# Altium project template.PrjPcb
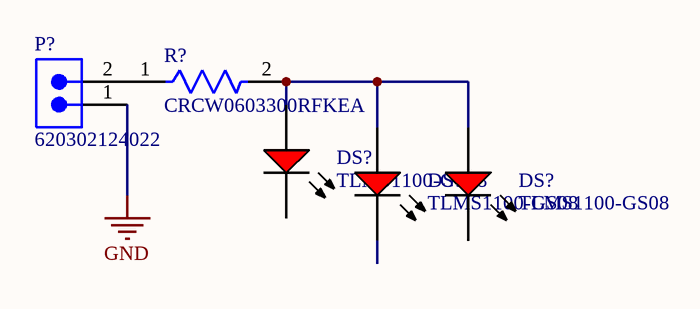
[diagram p0: TOP.SchDoc]
4 sheets, 31 parts. Net scope: hierarchical (ports join the sheet entries above them; power ports are global).
Board file: PCB.PcbDoc
Sheets:
  TOP.SchDoc
  Sensors.SchDoc
  STM.SchDoc
  Headers.SchDoc

## Sheet TOP.SchDoc: =DocumentName
size A4; Organization: Queen's Formula SAE; Address1: 130 Stuart St, Kingston; Address2: Ontario; Address3: Canada; Address4: K7L 2V9; DocumentNumber: 1; Revision: 0; SheetNumber: 1; SheetTotal: 1

### Parts
(Parts that share a designator on the sheet are numbered #1, #2 ... from top to bottom, then left to right.)
DS?#1  TLMS1100-GS08  [VISH-TLMX1100_V]
DS?#2  TLMS1100-GS08  [VISH-TLMX1100_V]
DS?#3  TLMS1100-GS08  [VISH-TLMX1100_V]
P?  620302124022  [620302124022]
R?  CRCW0603300RFKEA  [FP-CRCW0603-e3-IPC_A]

### Nets
GND: P?.1
NetDS?#1_1: DS?#1.1(A) DS?#2.1(A) DS?#3.1(A) R?.2
NetP?_2: P?.2 R?.1

Not connected (* = marked no-connect by the designer): DS?#1 2(K); DS?#2 2(K); DS?#3 2(K)

### Notes on the sheet
- Title
- Size:
- Date:
- A4
- Number:
- Time:
- Revision:
- Sheet
- of
- File:

### Library data of the parts
DS?#1-DS?#3 = CMP-1666-00027-1: LED, RED, 2.1 V, -40 to 100 degC, 2-Pin SMD (0603), RoHS, Tape and Reel; Type (Capacitors): C0G; Resistance: 100000000000 Ohm; Capacitance: 12 pF; Voltage Rating: 50 V; Tolerance: 5%; Min Operating Temperature: -55degC; REACH SVHC: No SVHC; ComponentLink2Description: Datasheet; ComponentLink1URL: http://www.vishay.com/; Width: 0.8 mm; Package Quantity: 4000; PackageReference: TLMX1100; ComponentLink2URL: http://www.vishay.com/docs/83173/tlmb1100.pdf; Case/Package: 0603; Case Code (Metric): 1608; Packaging: Tape and Reel; Pins: 2; ComponentLink1Description: Manufacturer URL; Max Operating Temperature: 125degC; Height: 0.8 mm; Length: 1.6 mm; Mount: Surface Mount; PackageDescription: 2-Pin Surface Mount Device, Body 1.6 x 0.8 mm; DatasheetVersion: Rev. 2.7, 03/2016; Case Code (Imperial): 0603; Voltage Rating (DC): 50 V; RoHSCompliant: True; Radiation Hardening: No
P? = CMP-1502-00660-2: NexarPartId: 18818242; Insulation: Insulated; Connector Type: Male Pin; Pitch: 2mm; Insulation Resistance: 1GΩ; Gender: Male; Voltage Rating: 125V; Number of Positions: 2; Contact Resistance: 20mΩ; Operating Supply Voltage: 100V; Current Rating: 2A; Contact Material: Copper; Number of Rows: 1; Flammability Rating: UL94 V-0; Housing Material: Nylon; Lead Pitch: 2mm; Orientation: Vertical; Max Operating Temperature: 85°C; Termination: SMD/SMT; REACH SVHC: Unknown; Contact Mating Length: 3.5052mm; RoHS: Compliant; Packaging: Tape and Reel; Number of Contacts: 2; Height: 6.6mm; Mount: Surface Mount; Number of Pins: 2; Contact Gender: Male; Min Operating Temperature: -40°C; Length: 5mm; Width: 7.9mm; Contact Plating: Tin; Color: Beige, White
R? = CMP-2000-03216-2: RES Thick Film, 300Ω, 1%, 0.1W, 100ppm/°C, 0603; Voltage Rating (DC): 75V; Power Rating: 100mW; Resistance: 300R; Length: 1.55mm; Height: 0.45mm; Case/Package: 0603; Temperature Coefficient: 100ppm/°C; Packaging: Tape and Reel; Termination: SMD/SMT; Depth: 0.85mm; Max Operating Temperature: 155°C; Radiation Hardening: No; Tolerance: 1%; Lead Free: Lead Free; Case Code (Metric): 1608; Voltage Rating: 75V; Weight: 7.1E-05oz; Package Quantity: 10; Military Standard: Not; Case Code (Imperial): 0603; Composition: Thick Film; Min Operating Temperature: -55°C; Width: 0.033inch; Number of Terminations: 2; Mount: Surface Mount; Features: Automotive AEC-Q200; Contact Plating: Tin; Max Power Dissipation: 100mW

## Sheet Sensors.SchDoc
size A4
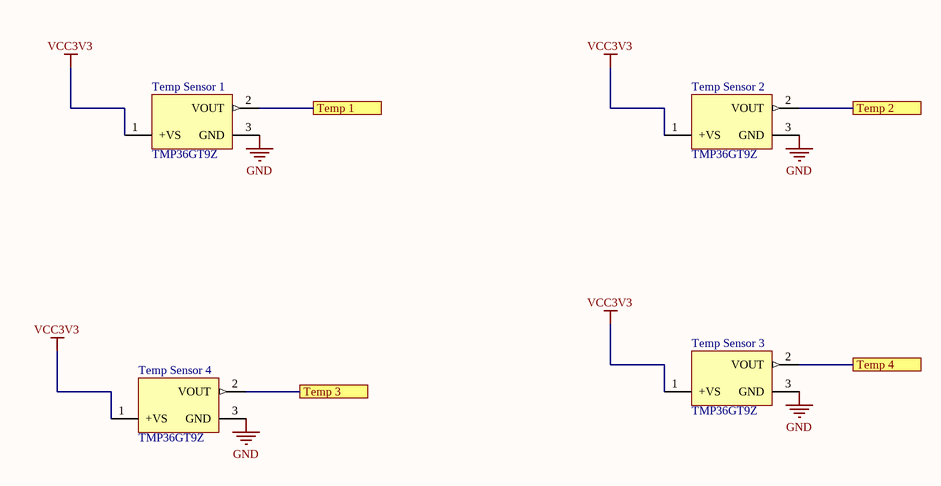
[diagram p1: Sensors.SchDoc]

### Parts
Temp_Sensor_1  TMP36GT9Z  [ADI-T-3]
Temp_Sensor_2  TMP36GT9Z  [ADI-T-3]
Temp_Sensor_3  TMP36GT9Z  [ADI-T-3]
Temp_Sensor_4  TMP36GT9Z  [ADI-T-3]

### Ports
Temp 1, Temp 2, Temp 3, Temp 4

### Nets
GND: Temp_Sensor_1.3(GND) Temp_Sensor_2.3(GND) Temp_Sensor_3.3(GND) Temp_Sensor_4.3(GND)
VCC3V3: Temp_Sensor_1.1(+VS) Temp_Sensor_2.1(+VS) Temp_Sensor_3.1(+VS) Temp_Sensor_4.1(+VS)
Temp 1: Temp_Sensor_1.2(VOUT) ; port Temp 1
Temp 2: Temp_Sensor_2.2(VOUT) ; port Temp 2
Temp 3: Temp_Sensor_4.2(VOUT) ; port Temp 3
Temp 4: Temp_Sensor_3.2(VOUT) ; port Temp 4

### Library data of the parts
Temp_Sensor_1-Temp_Sensor_4 = CMP-0887-00067-1: Low Voltage Temperature Sensor, 2.7 to 5.5 V Supply, Industrial, 3-pin TO92 (T-3), Tray; Manufacturer: Analog Devices; ComponentLink2Description: Datasheet; PackageReference: T-3; Packing: Tray; ComponentLink2URL: http://www.analog.com/static/imported-files/data_sheets/TMP35_36_37.pdf; ComponentLink4Description: Product URL; ComponentLink3Description: Package Specification; Code_JEDEC: TO-226-AA; PartNumber: TMP36GT9Z; PackageDescription: 3-Pin Plastic Header-Style Package, 1.27 mm Pitch; PackageVersion: 042208-A, 04/2008; ComponentLink3URL: http://www.analog.com/static/imported-files/packages/PKG_PDF/TO-92(T)/T_3.pdf; ComponentLink1Description: Manufacturer URL; Supply Voltage Range: 2.7 to 5.5 V; Mounting Technology: Through Hole; DatasheetVersion: Rev. F; ComponentLink4URL: http://www.analog.com/en/mems-sensors/digital-temperature-sensors/tmp36/products/product.html; ComponentLink1URL: http://www.analog.com/en/index.html

## Sheet STM.SchDoc
size A4
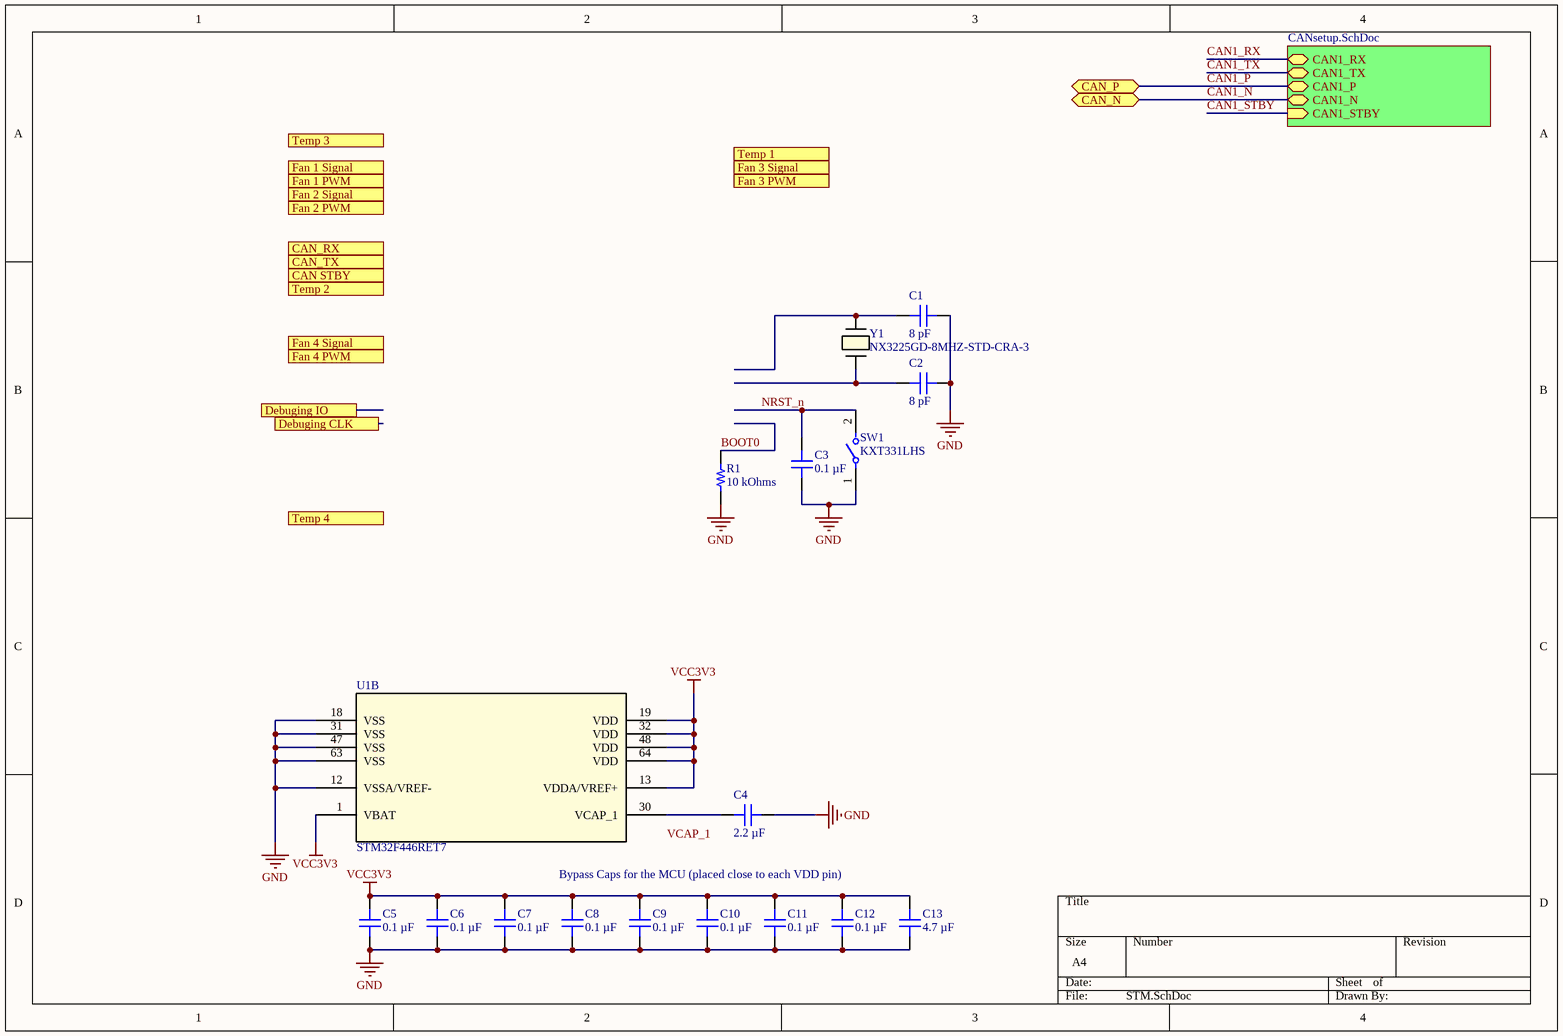
[diagram p2: STM.SchDoc]

### Parts
C1  8 pF  [CAP 0402_1005]
C2  8 pF  [CAP 0402_1005]
C3  0.1 µF  [CAP 01005_0402]
C4  2.2 µF  [CAP 0402_1005]
C5  0.1 µF  [CAP 01005_0402]
C6  0.1 µF  [CAP 01005_0402]
C7  0.1 µF  [CAP 01005_0402]
C8  0.1 µF  [CAP 01005_0402]
C9  0.1 µF  [CAP 01005_0402]
C10  0.1 µF  [CAP 01005_0402]
C11  0.1 µF  [CAP 01005_0402]
C12  0.1 µF  [CAP 01005_0402]
C13  4.7 µF  [CAP 0402_1005]
R1  10 kOhms  [RES 0201_0603]
SW1  KXT331LHS  [FP-KXT331LHS-MFG]
U1  STM32F446RET7  [LQFP64-10x10mm]  (part B of 2)
Y1  NX3225GD-8MHZ-STD-CRA-3  [XTAL_NX3225GD-8MHZ-STD-CRA-3_NDK]

### Sub-sheets
CAN = CANsetup.SchDoc (file not in this document): CAN1_RX (bidir), CAN1_TX (bidir), CAN1_STBY (in), CAN1_P (bidir), CAN1_N (bidir)

### Ports
CAN STBY, CAN_N (bidir), CAN_P (bidir), CAN_RX, CAN_TX, Debuging CLK, Debuging IO, Fan 1 PWM, Fan 1 Signal, Fan 2 PWM, Fan 2 Signal, Fan 3 PWM, Fan 3 Signal, Fan 4 PWM, Fan 4 Signal, Temp 1, Temp 2, Temp 3, Temp 4

### Nets
GND: C1.1 C2.1 C3.2 C4.1 C5.2 C6.2 C7.2 C8.2 C9.2 C10.2 C11.2 C12.2 C13.1 R1.1 SW1.1 U1.12(VSSA/VREF-) U1.18(VSS) U1.31(VSS) U1.47(VSS) U1.63(VSS)
VCC3V3: C5.1 C6.1 C7.1 C8.1 C9.1 C10.1 C11.1 C12.1 C13.2 U1.1(VBAT) U1.13(VDDA/VREF+) U1.19(VDD) U1.32(VDD) U1.48(VDD) U1.64(VDD)
BOOT0: R1.2
CAN1_N: port CAN_N, sheet CAN/CAN1_N
CAN1_P: port CAN_P, sheet CAN/CAN1_P
CAN1_RX: sheet CAN/CAN1_RX
CAN1_STBY: sheet CAN/CAN1_STBY
CAN1_TX: sheet CAN/CAN1_TX
NRST_n: C3.1 SW1.2
NetC1_2: C1.2 Y1.1
NetC2_2: C2.2 Y1.2
NetC4_2: C4.2 U1.30(VCAP_1)

### Notes on the sheet
- Bypass Caps for the MCU (placed close to each VDD pin)
- Labels drawn without touching a wire or pin: VCAP_1

### Library data of the parts
C1 C2 = GCM1555C1H8R0FA16D: CAP CER 8PF 50V C0G/NP0 0402; manufacturer: Murata Electronics; Temperature Coefficient: C0G, NP0; Tolerance: ±1%; Part Number: GCM1555C1H8R0FA16D; Value: 8 pF; Applications: Automotive; Capacitance: 8 pF; componentlink1description: Datasheet; componentlink1url: https://search.murata.co.jp/Ceramy/image/img/A01X/G101/ENG/GCM1555C1H8R0FA16-01.pdf; componentlink2description: DigiKey Link; componentlink2url: https://www.digikey.com/en/products/detail/murata-electronics/GCM1555C1H8R0FA16D/11618789; Device Package: 0402 (1005 Metric); lastupdated: 2024-01-11 8:04:05 PM; Lifecycle Status: Active; Minimum Order: 1; Mounting Type: Surface Mount, MLCC; Operating Temperature: -55°C ~ 125°C; Package / Case: 0402 (1005 Metric); packaging: TapeAndReel; partid: 34002; Part Status: Active; price: 0.01; Ratings: AEC-Q200; series: GCM; Size / Dimension: 0.039" L x 0.020" W (1.00mm x 0.50mm); Supplier 1: DigiKey; Supplier Part Number 1: 490-GCM1555C1H8R0FA16DCT-ND; Thickness (Max): 0.022" (0.55mm); Voltage - Rated: 50V
C3 C5-C12 = CL02A104KQ2NNNC: CAP CER 0.1UF 6.3V X5R 01005; manufacturer: Samsung Electro-Mechanics; Tolerance: ±10%; Part Number: CL02A104KQ2NNNC; Value: 0.1 µF; Applications: General Purpose; Capacitance: 0.1 µF; componentlink1description: Datasheet; componentlink1url: http://www.samsungsem.com/kr/support/product-search/mlcc/CL02A104KQ2NNNC.jsp; componentlink2description: DigiKey Link; componentlink2url: https://www.digikey.com/en/products/detail/samsung-electro-mechanics/CL02A104KQ2NNNC/3886867; Device Package: 01005 (0402 Metric); lastupdated: 2023-11-30 9:46:05 PM; Lifecycle Status: Active; Minimum Order: 1; Mounting Type: Surface Mount, MLCC; Operating Temperature: -55°C ~ 85°C; Package / Case: 01005 (0402 Metric); packaging: TapeAndReel; Part Status: Active; price: 0.02; series: CL; Size / Dimension: 0.016" L x 0.008" W (0.40mm x 0.20mm); Supplier 1: DigiKey; Supplier Part Number 1: 1276-1209-1-ND; Temperature Coefficient: X5R; Thickness (Max): 0.009" (0.22mm); Voltage - Rated: 6.3V
C4 = CL05A225KO5NQNC: CAP CER 2.2UF 16V X5R 0402; manufacturer: Samsung Electro-Mechanics; Tolerance: ±10%; Part Number: CL05A225KO5NQNC; Value: 2.2 µF; Applications: General Purpose; Capacitance: 2.2 µF; componentlink1description: Datasheet; componentlink1url: http://www.samsungsem.com/kr/support/product-search/mlcc/CL05A225KO5NQNC.jsp; componentlink2description: DigiKey Link; componentlink2url: https://www.digikey.com/en/products/detail/samsung-electro-mechanics/CL05A225KO5NQNC/3887119; Device Package: 0402 (1005 Metric); lastupdated: 2024-01-11 8:04:27 PM; Lifecycle Status: Active; Minimum Order: 1; Mounting Type: Surface Mount, MLCC; Operating Temperature: -55°C ~ 85°C; Package / Case: 0402 (1005 Metric); packaging: TapeAndReel; partid: 1761; Part Status: Active; price: 0.03; series: CL; Size / Dimension: 0.039" L x 0.020" W (1.00mm x 0.50mm); Supplier 1: DigiKey; Supplier Part Number 1: 1276-1461-1-ND; Temperature Coefficient: X5R; Thickness (Max): 0.022" (0.55mm); Voltage - Rated: 16V
C13 = CL05A475MO5NUNC: CAP CER 4.7UF 16V X5R 0402; manufacturer: Samsung Electro-Mechanics; Tolerance: ±20%; Part Number: CL05A475MO5NUNC; Value: 4.7 µF; Applications: General Purpose; Capacitance: 4.7 µF; componentlink1description: Datasheet; componentlink1url: http://www.samsungsem.com/kr/support/product-search/mlcc/__icsFiles/afieldfile/2019/05/29/Data%20sheet_CL05A475MO5NUNC.pdf; componentlink2description: DigiKey Link; componentlink2url: https://www.digikey.com/en/products/detail/samsung-electro-mechanics/CL05A475MO5NUNC/5961320; Device Package: 0402 (1005 Metric); lastupdated: 2024-01-11 8:04:27 PM; Lifecycle Status: Active; Minimum Order: 1; Mounting Type: Surface Mount, MLCC; Operating Temperature: -55°C ~ 85°C; Package / Case: 0402 (1005 Metric); packaging: TapeAndReel; partid: 1760; Part Status: Active; price: 0.08; series: CL; Size / Dimension: 0.039" L x 0.020" W (1.00mm x 0.50mm); Supplier 1: DigiKey; Supplier Part Number 1: 1276-6836-1-ND; Temperature Coefficient: X5R; Thickness (Max): 0.028" (0.70mm); Voltage - Rated: 16V
R1 = CRCW020110K0FKED: RES SMD 10K OHM 1% 1/20W 0201; Manufacturer: Vishay Dale; Power (Watts): 0.05W, 1/20W; Temperature Coefficient: ±100ppm/°C; Part Number: CRCW020110K0FKED; Value: 10 kOhms; ComponentLink1Description: Datasheet; ComponentLink1URL: http://www.vishay.com/docs/20052/crcw0201e3.pdf; ComponentLink2Description: DigiKey Link; ComponentLink2URL: https://www.digikey.com/en/products/detail/vishay-dale/CRCW020110K0FKED/1967989; Composition: Thick Film; Device Package: 0201 (0603 Metric); Height - Seated (Max): 0.010" (0.26mm); LastUpdated: 2024-01-11 8:21:19 PM; Lifecycle Status: Active; Minimum Order: 1; Number of Terminations: 2; Operating Temperature: -55°C ~ 155°C; Package / Case: 0201 (0603 Metric); Packaging: TapeAndReel; PartId: 29; Part Status: Active; Price: 0.02; Resistance: 10 kOhms; Series: CRCW; Size / Dimension: 0.024" L x 0.012" W (0.60mm x 0.30mm); Supplier 1: DigiKey; Supplier Part Number 1: 541-10.0KAABCT-ND; Supplier Device Package: 0201; Tolerance: ±1%
SW1 = CMP-10040-000029-1: SWITCH TACTILE SPST-NO 0.02A 15V; Operating Force: 240gf; Switch Travel: 0.13mm; Illumination Type: Non-Illuminated; Throw Configuration: SPST; Number of Ports: 1; Current Rating: 5A; Mechanical Life: 500000Cycles; Switch Function: Off-Mom; Connector Type: USB; Actuator Type: Standard; Gender: Receptacle; Number of Contacts: 24; Contact Plating: Gold; Insulation Color: Black; Min Operating Temperature: -40°C; Packaging: Tape and Reel; Flammability Rating: UL94 V-0; Max Operating Temperature: 85°C; Termination: Solder; Mount: Surface Mount
U1 = STM32F446RET7: No Description Available; Mfr_Name: STMicroelectronics; Copyright: Copyright (C) 2024 Ultra Librarian. All rights reserved.; Manufacturer_Part_Number: STM32F446RET7; RefDes: RefDes; Type: DEV
Y1 = NX3225GD-8MHZ-STD-CRA-3: No Description Available; Mfr_Name: NDK; Copyright: Copyright (C) 2024 Ultra Librarian. All rights reserved.; Manufacturer_Part_Number: NX3225GD-8MHZ-STD-CRA-3; RefDes: RefDes; Type: DEV

## Sheet Headers.SchDoc
size A4
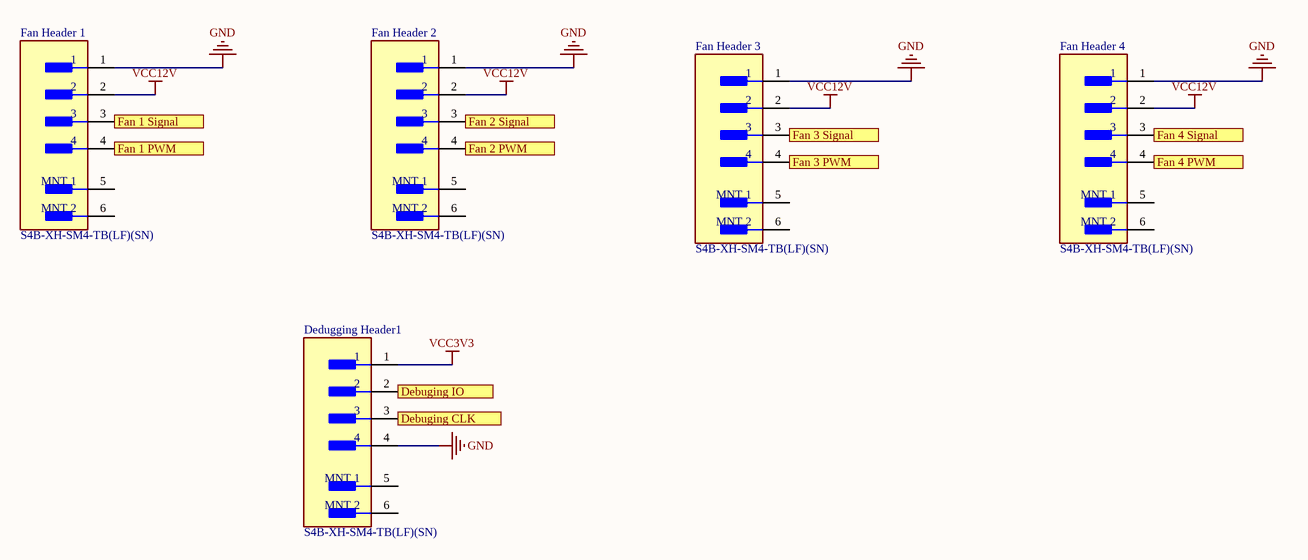
[diagram p3: Headers.SchDoc]

### Parts
Dedugging_Header1  S4B-XH-SM4-TB(LF)(SN)  [FP-S4B-XH-SM4-TB_LF_SN-MFG]
Fan_Header_1  S4B-XH-SM4-TB(LF)(SN)  [FP-S4B-XH-SM4-TB_LF_SN-MFG]
Fan_Header_2  S4B-XH-SM4-TB(LF)(SN)  [FP-S4B-XH-SM4-TB_LF_SN-MFG]
Fan_Header_3  S4B-XH-SM4-TB(LF)(SN)  [FP-S4B-XH-SM4-TB_LF_SN-MFG]
Fan_Header_4  S4B-XH-SM4-TB(LF)(SN)  [FP-S4B-XH-SM4-TB_LF_SN-MFG]

### Ports
Debuging CLK, Debuging IO, Fan 1 PWM, Fan 1 Signal, Fan 2 PWM, Fan 2 Signal (out), Fan 3 PWM, Fan 3 Signal, Fan 4 PWM, Fan 4 Signal

### Nets
GND: Dedugging_Header1.4 Fan_Header_1.1 Fan_Header_2.1 Fan_Header_3.1 Fan_Header_4.1
VCC3V3: Dedugging_Header1.1
VCC12V: Fan_Header_1.2 Fan_Header_2.2 Fan_Header_3.2 Fan_Header_4.2
Debuging CLK: Dedugging_Header1.3 ; port Debuging CLK
Debuging IO: Dedugging_Header1.2 ; port Debuging IO
Fan 1 PWM: Fan_Header_1.4 ; port Fan 1 PWM
Fan 1 Signal: Fan_Header_1.3 ; port Fan 1 Signal
Fan 2 PWM: Fan_Header_2.4 ; port Fan 2 PWM
Fan 2 Signal: Fan_Header_2.3 ; port Fan 2 Signal
Fan 3 PWM: Fan_Header_3.4 ; port Fan 3 PWM
Fan 3 Signal: Fan_Header_3.3 ; port Fan 3 Signal
Fan 4 PWM: Fan_Header_4.4 ; port Fan 4 PWM
Fan 4 Signal: Fan_Header_4.3 ; port Fan 4 Signal

Not connected (* = marked no-connect by the designer): Dedugging_Header1 5(MNT_1) 6(MNT_2); Fan_Header_1 5(MNT_1) 6(MNT_2); Fan_Header_2 5(MNT_1) 6(MNT_2); Fan_Header_3 5(MNT_1) 6(MNT_2); Fan_Header_4 5(MNT_1) 6(MNT_2)

### Library data of the parts
Dedugging_Header1 Fan_Header_1-Fan_Header_4 = CMP-17439-000072-1: CONN HEADER SMD R/A 4POS 2.5MM; Number of Positions: 4; Max Current Rating: 3A; Max Voltage Rating (AC): 250V; Connector Type: Male Pin; Contact Resistance: 20mR; Gender: Male; Pitch: 0.098inch; Max Operating Temperature: 85°C; Contact Plating: Tin; Housing Material: Polyamide; Housing Color: Beige; Depth: 10mm; Series: XH; Package Quantity: 1; Length: 15mm; Contact Material: Copper Alloy; Min Operating Temperature: -25°C; REACH SVHC: No SVHC; Orientation: Right Angle; Number of Rows: 1; Contact Type: Male Pin; Color: Natural; Lead Free: Lead Free; Termination: Solder; Mount: Surface Mount; Number of Contacts: 4; Packaging: Tape and Reel

## Nets that join several sheets
GND: TOP (P?.1), Sensors (Temp_Sensor_1.3 Temp_Sensor_2.3 Temp_Sensor_3.3 Temp_Sensor_4.3), STM (20 pins), Headers (5 pins)
VCC3V3: Sensors (Temp_Sensor_1.1 Temp_Sensor_2.1 Temp_Sensor_3.1 Temp_Sensor_4.1), STM (15 pins), Headers (Dedugging_Header1.1)